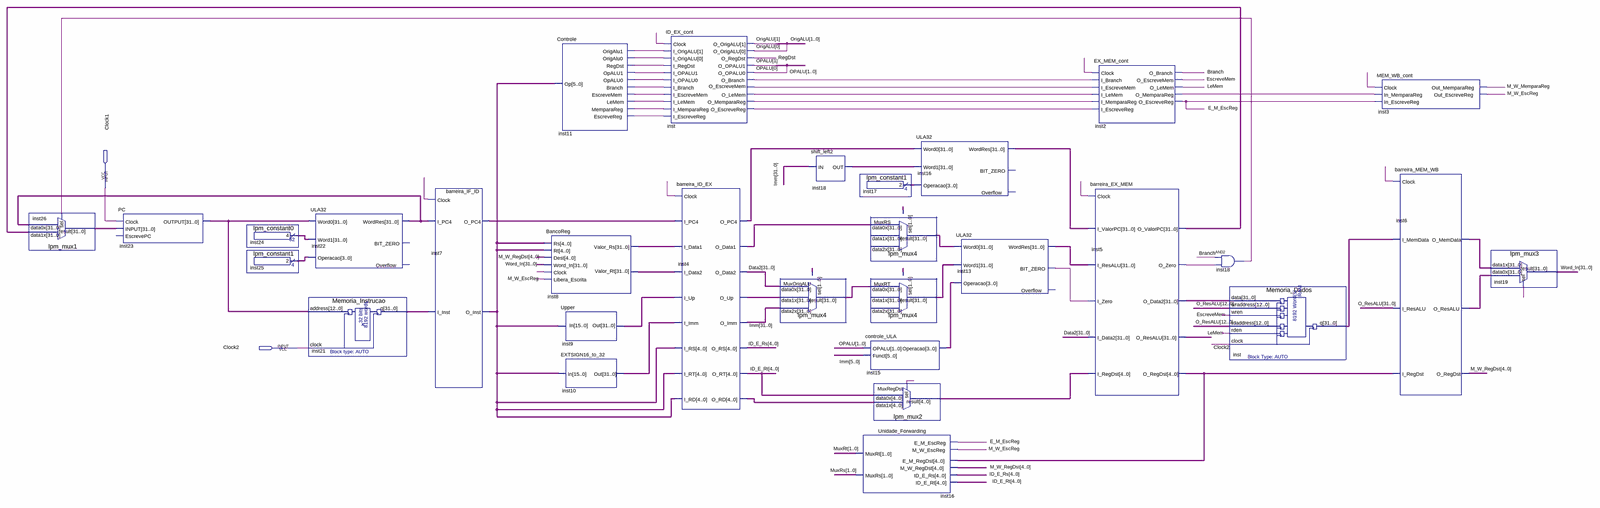
[diagram p0: schematic sheet, whole]
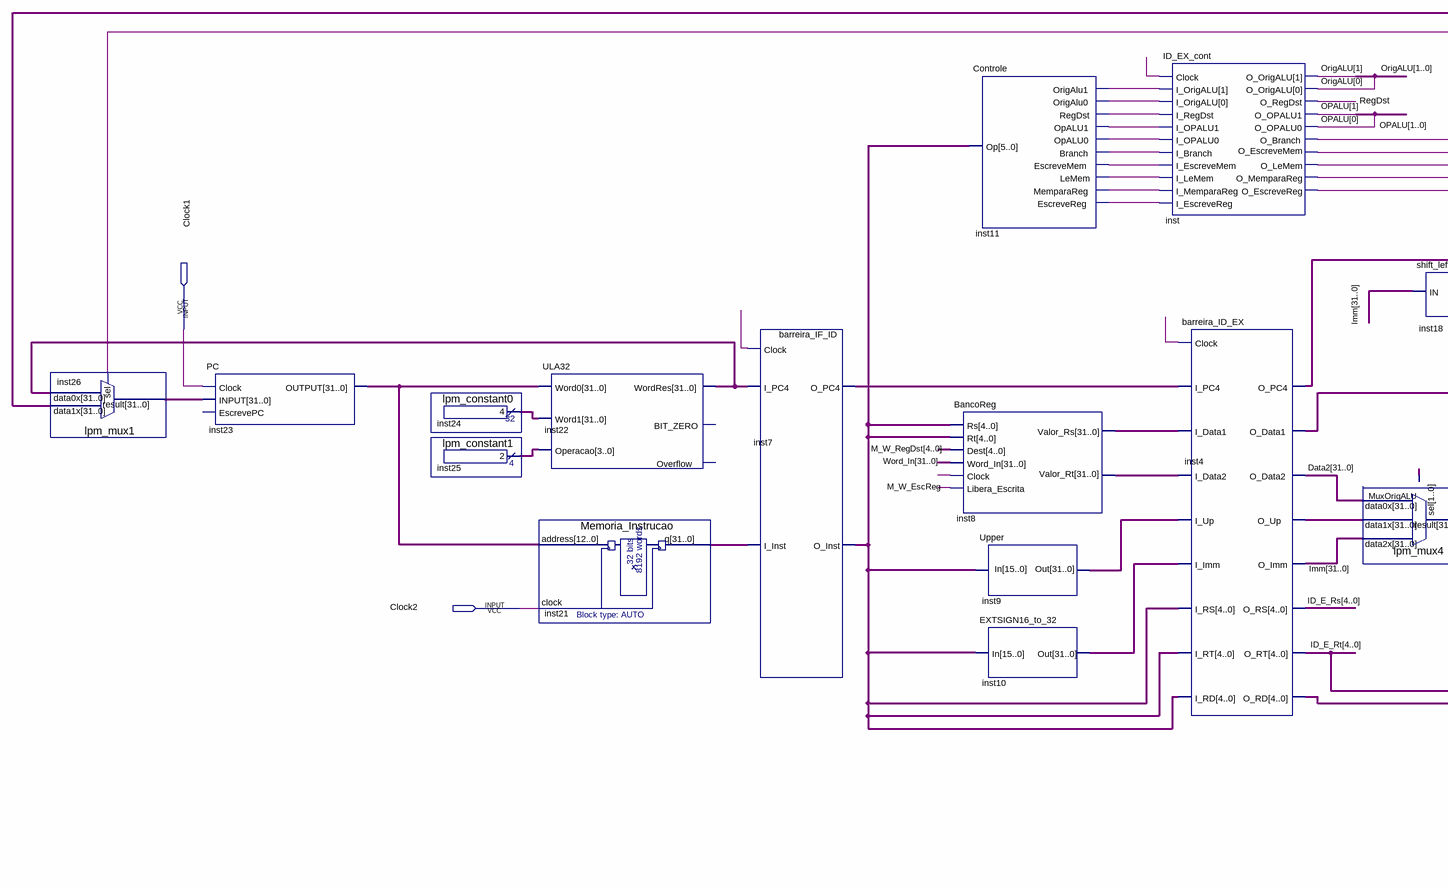
[diagram p1: schematic sheet, left part]
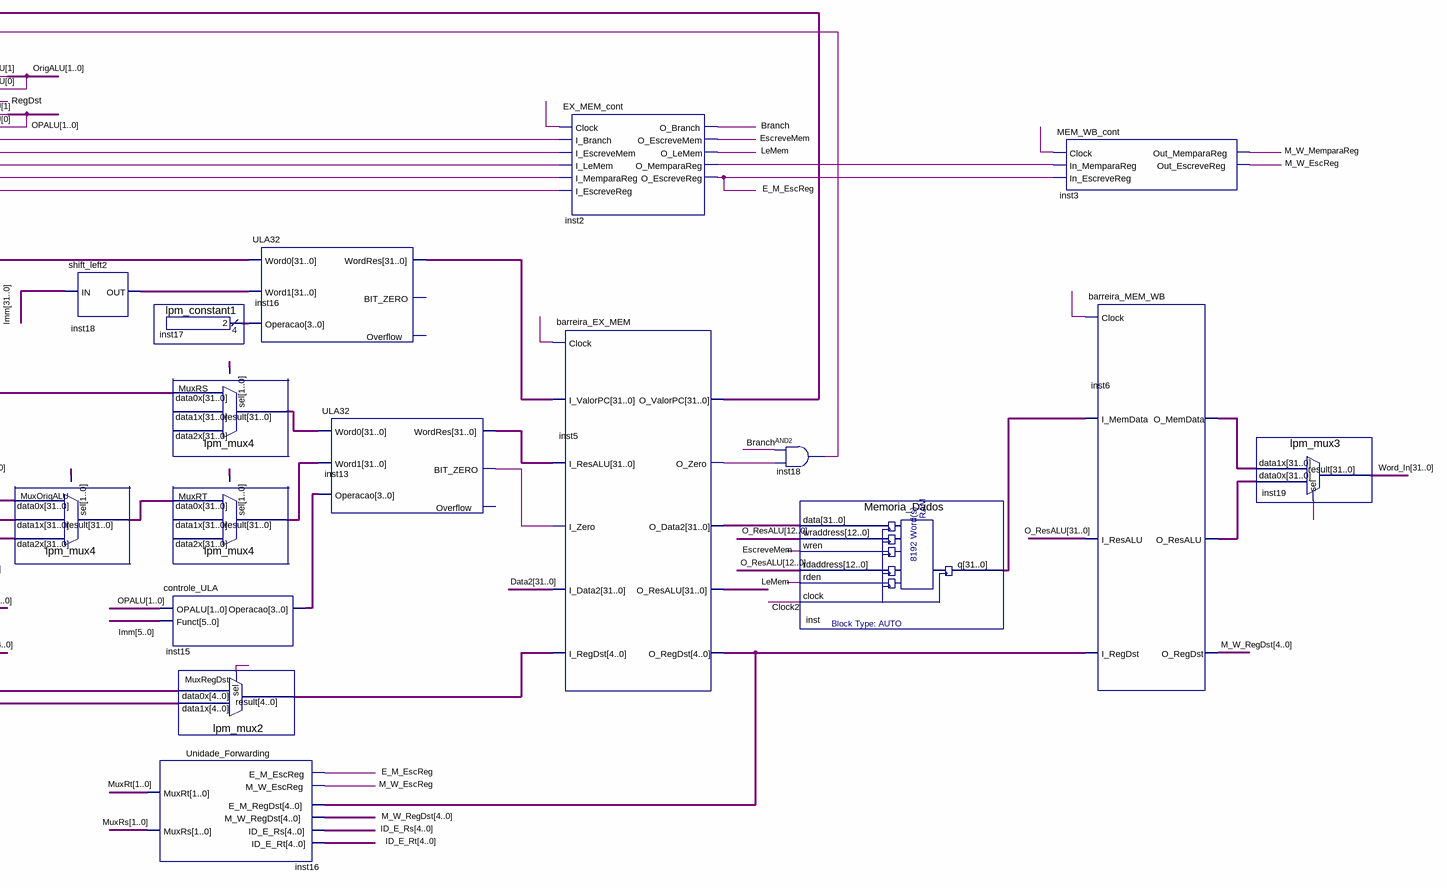
[diagram p2: schematic sheet, right part]
// Quartus schematic PIPELINE_PROC.bdf as structural Verilog: 30 symbols, 2 pins
module PIPELINE_PROC (
  input  Clock1,
  input  Clock2
);

  wire Branch, E_M_EscReg, EscreveMem, inst2_o_memparareg, inst5_o_zero, inst7_o_pc4, inst11_branch,
       inst11_escrevemem, inst11_escrevereg, inst11_lemem, inst11_memparareg, inst11_opalu0, inst11_opalu1,
       inst11_origalu0, inst11_origalu1, inst11_regdst, inst13_bit_zero, inst18_out_2, inst_o_branch,
       inst_o_escrevemem, inst_o_escrevereg, inst_o_lemem, inst_o_memparareg, LeMem, M_W_EscReg,
       M_W_MemparaReg, RegDst;
  wire [1:0] MuxRs, MuxRt, OPALU, OrigALU;
  wire [3:0] inst15_operacao, inst17_result, inst25_result;
  wire [4:0] ID_E_Rs, ID_E_Rt, inst4_o_rd, inst5_o_regdst, M_W_RegDst, MuxRegDst_result;
  wire [31:0] Data2, Imm, inst4_o_data1, inst4_o_pc4, inst4_o_up, inst5_o_data2, inst5_o_valorpc,
       inst6_o_memdata, inst6_o_resalu, inst8_valor_rs, inst8_valor_rt, inst9_out, inst10_out,
       inst13_wordres, inst16_wordres, inst18_out, inst21_q, inst22_wordres, inst23_output, inst24_result,
       inst26_result, inst_q, Instrucao, MuxOrigALU_result, MuxRS_result, MuxRT_result, O_ResALU, Word_In;

  lpm_mux1 inst26 (.data1x(inst5_o_valorpc), .data0x(inst22_wordres), .sel(inst18_out_2), .result(inst26_result));
  PC inst23 (.Clock(Clock1), .INPUT(inst26_result), .OUTPUT(inst23_output));  // open: EscrevePC
  lpm_constant0 inst24 (.result(inst24_result));
  lpm_constant1 inst25 (.result(inst25_result));
  ULA32 inst22 (
    .Word0(inst23_output), .Word1(inst24_result), .Operacao(inst25_result), .WordRes(inst22_wordres));  // open: BIT_ZERO, Overflow
  Memoria_Instrucao inst21 (.address(inst23_output), .clock(Clock2), .q(inst21_q));
  barreira_IF_ID inst7 (
    .Clock(Clock1), .I_PC4(inst22_wordres), .I_Inst(inst21_q), .O_PC4(inst7_o_pc4), .O_Inst(Instrucao));
  Controle inst11 (
    .Op(Instrucao[31:26]), .OrigAlu1(inst11_origalu1), .OrigAlu0(inst11_origalu0), .RegDst(inst11_regdst),
    .OpALU1(inst11_opalu1), .OpALU0(inst11_opalu0), .Branch(inst11_branch), .EscreveMem(inst11_escrevemem),
    .LeMem(inst11_lemem), .MemparaReg(inst11_memparareg), .EscreveReg(inst11_escrevereg));
  BancoReg inst8 (
    .Rt(Instrucao[20:16]), .Rs(Instrucao[25:21]), .Clock(Clock1), .Libera_Escrita(M_W_EscReg),
    .Dest(M_W_RegDst), .Word_In(Word_In), .Valor_Rs(inst8_valor_rs), .Valor_Rt(inst8_valor_rt));
  Upper inst9 (.In(Instrucao[15:0]), .Out(inst9_out));
  EXTSIGN16_to_32 inst10 (.In(Instrucao[15:0]), .Out(inst10_out));
  ID_EX_cont inst (
    .Clock(Clock1), .I_OrigALU({inst11_origalu1, inst11_origalu0}), .I_RegDst(inst11_regdst),
    .I_OPALU1(inst11_opalu1), .I_OPALU0(inst11_opalu0), .I_Branch(inst11_branch),
    .I_EscreveMem(inst11_escrevemem), .I_LeMem(inst11_lemem), .I_MemparaReg(inst11_memparareg),
    .I_EscreveReg(inst11_escrevereg), .O_OrigALU(OrigALU), .O_RegDst(RegDst), .O_OPALU1(OPALU[1]),
    .O_OPALU0(OPALU[0]), .O_Branch(inst_o_branch), .O_EscreveMem(inst_o_escrevemem), .O_LeMem(inst_o_lemem),
    .O_MemparaReg(inst_o_memparareg), .O_EscreveReg(inst_o_escrevereg));
  barreira_ID_EX inst4 (
    .Clock(Clock1), .I_PC4(inst7_o_pc4), .I_Data1(inst8_valor_rs), .I_Data2(inst8_valor_rt),
    .I_Imm(inst10_out), .I_RT(Instrucao), .I_RD(Instrucao), .I_Up(inst9_out), .I_RS(Instrucao),
    .O_PC4(inst4_o_pc4), .O_Data1(inst4_o_data1), .O_Data2(Data2), .O_Imm(Imm), .O_RT(ID_E_Rt),
    .O_RD(inst4_o_rd), .O_Up(inst4_o_up), .O_RS(ID_E_Rs));
  lpm_mux4 MuxOrigALU (.data2x(Imm), .data1x(inst4_o_up), .data0x(Data2), .sel(OrigALU), .result(MuxOrigALU_result));
  shift_left2 inst18 (.IN(Imm), .OUT(inst18_out));
  lpm_constant1 inst17 (.result(inst17_result));
  lpm_mux4 u_MuxRS (.data0x(inst4_o_data1), .sel(MuxRs), .result(MuxRS_result));  // open: data2x, data1x
  lpm_mux4 u_MuxRT (.data0x(MuxOrigALU_result), .sel(MuxRt), .result(MuxRT_result));  // open: data2x, data1x
  controle_ULA inst15 (.OPALU(OPALU), .Funct(Imm[5:0]), .Operacao(inst15_operacao));
  lpm_mux2 MuxRegDst (.data1x(inst4_o_rd), .data0x(ID_E_Rt), .sel(RegDst), .result(MuxRegDst_result));
  Unidade_Forwarding inst16 (
    .E_M_EscReg(E_M_EscReg), .M_W_EscReg(M_W_EscReg), .E_M_RegDst(inst5_o_regdst), .M_W_RegDst(M_W_RegDst),
    .ID_E_Rs(ID_E_Rs), .ID_E_Rt(ID_E_Rt), .MuxRt(MuxRt), .MuxRs(MuxRs));
  ULA32 inst16_dup2 (
    .Word0(inst4_o_pc4), .Word1(inst18_out), .Operacao(inst17_result), .WordRes(inst16_wordres));  // open: BIT_ZERO, Overflow
  ULA32 inst13 (
    .Word0(MuxRS_result), .Word1(MuxRT_result), .Operacao(inst15_operacao), .BIT_ZERO(inst13_bit_zero),
    .WordRes(inst13_wordres));  // open: Overflow
  EX_MEM_cont inst2 (
    .Clock(Clock1), .I_Branch(inst_o_branch), .I_EscreveMem(inst_o_escrevemem), .I_LeMem(inst_o_lemem),
    .I_MemparaReg(inst_o_memparareg), .I_EscreveReg(inst_o_escrevereg), .O_Branch(Branch),
    .O_EscreveMem(EscreveMem), .O_LeMem(LeMem), .O_MemparaReg(inst2_o_memparareg), .O_EscreveReg(E_M_EscReg));
  barreira_EX_MEM inst5 (
    .Clock(Clock1), .I_ValorPC(inst16_wordres), .I_Zero(inst13_bit_zero), .I_ResALU(inst13_wordres),
    .I_Data2(Data2), .I_RegDst(MuxRegDst_result), .O_ValorPC(inst5_o_valorpc), .O_Zero(inst5_o_zero),
    .O_ResALU(O_ResALU), .O_Data2(inst5_o_data2), .O_RegDst(inst5_o_regdst));
  and inst18_dup2 (inst18_out_2, Branch, inst5_o_zero);
  Memoria_Dados inst_dup2 (
    .data(inst5_o_data2), .wraddress(O_ResALU[12:0]), .wren(EscreveMem), .rdaddress(O_ResALU[12:0]),
    .rden(LeMem), .clock(Clock2), .q(inst_q));
  MEM_WB_cont inst3 (
    .Clock(Clock1), .In_MemparaReg(inst2_o_memparareg), .In_EscreveReg(E_M_EscReg),
    .Out_MemparaReg(M_W_MemparaReg), .Out_EscreveReg(M_W_EscReg));
  barreira_MEM_WB inst6 (
    .Clock(Clock1), .I_MemData(inst_q), .I_ResALU(O_ResALU), .I_RegDst(inst5_o_regdst),
    .O_MemData(inst6_o_memdata), .O_ResALU(inst6_o_resalu), .O_RegDst(M_W_RegDst));
  lpm_mux3 inst19 (.data1x(inst6_o_memdata), .data0x(inst6_o_resalu), .sel(M_W_MemparaReg), .result(Word_In));
endmodule
